# EAGLE design audio_board (EAGLE 9.0.1)
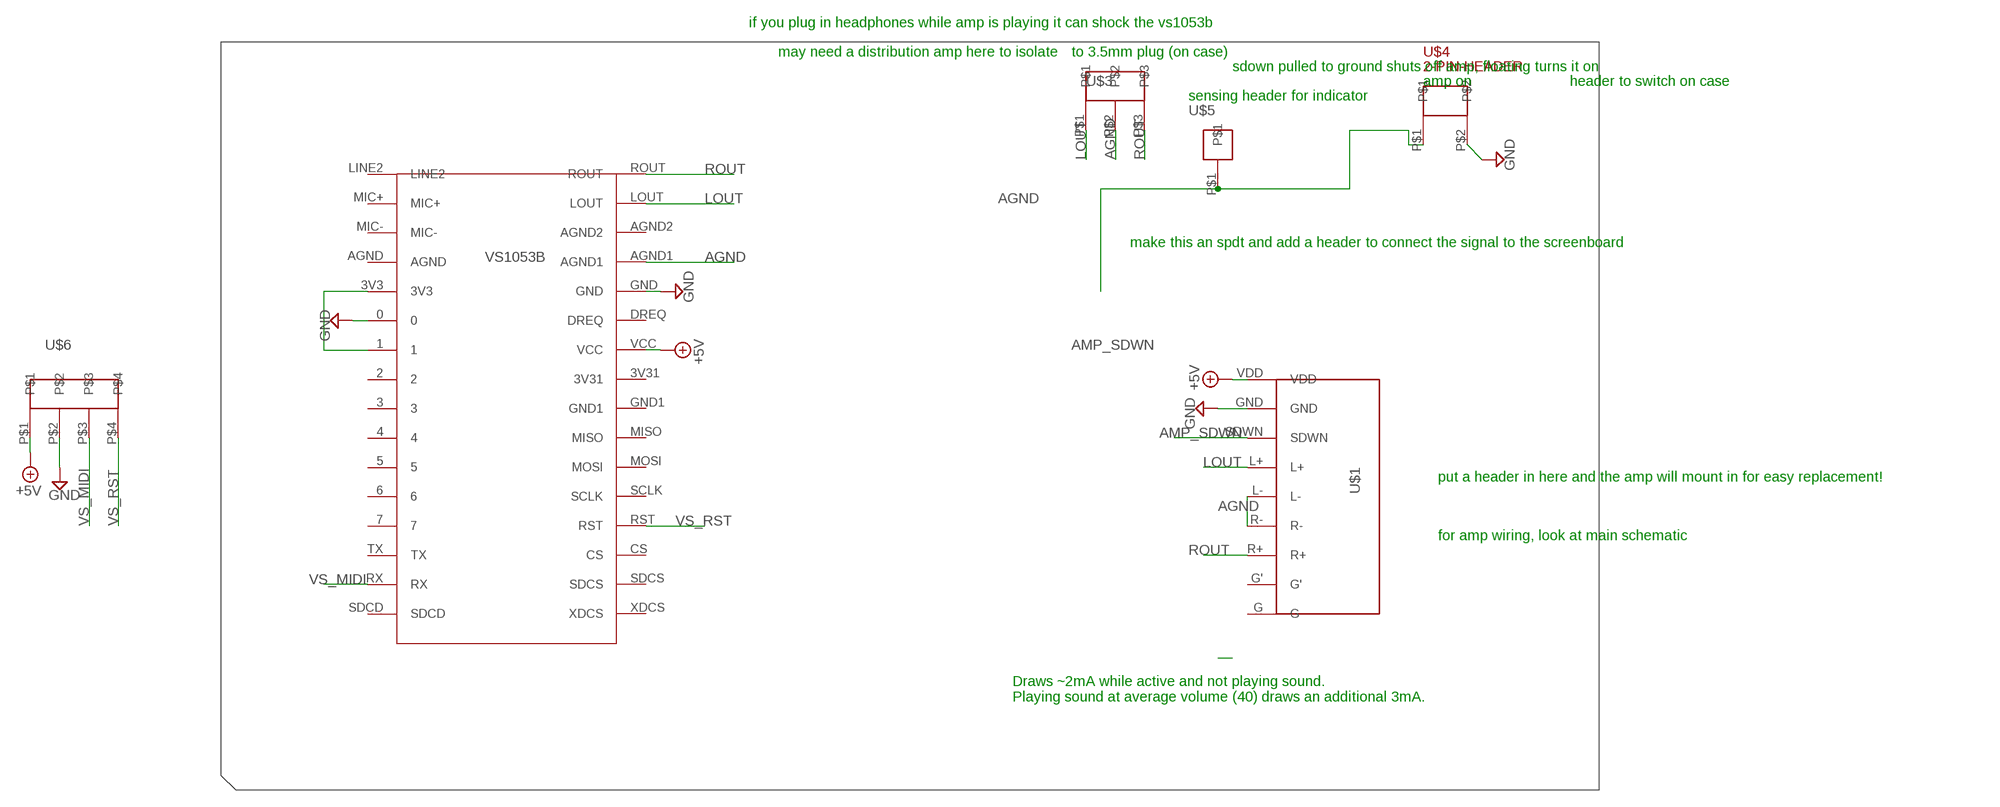
[diagram p0: schematic, sheet 1]

## Parts
U$1  AUDIOAMP  [AUDIOAMP]
U$3  3-PIN-HEADER  [3-PIN-HEADER]
U$4  2-PIN-HEADER  [2-PIN-HEADER]
U$5  1-PIN-HEADER  [1-PIN-HEADER]
U$6  4-PIN-HEADER  [4-PIN-HEADER]
VS1053B  VS1053B  [VS1053B]

## Nets
+5V: U$1.VDD U$6.P$1 VS1053B.VCC
AGND: U$1.L- U$1.R- U$3.P$2 VS1053B.AGND1
AMP_SDWN: U$1.SDWN U$4.P$1 U$5.P$1
GND: U$1.GND U$4.P$2 U$6.P$2 VS1053B.0 VS1053B.GND
LOUT: U$1.L+ U$3.P$1 VS1053B.LOUT
N$1: VS1053B.1 VS1053B.3V3
ROUT: U$1.R+ U$3.P$3 VS1053B.ROUT
VS_MIDI: U$6.P$3 VS1053B.RX
VS_RST: U$6.P$4 VS1053B.RST
Unconnected: U$1.G U$1.G' VS1053B.2 VS1053B.3 VS1053B.3V31 VS1053B.4 VS1053B.5 VS1053B.6 VS1053B.7 VS1053B.AGND VS1053B.AGND2 VS1053B.CS VS1053B.DREQ VS1053B.GND1 VS1053B.LINE2 VS1053B.MIC+ VS1053B.MIC- VS1053B.MISO VS1053B.MOSI VS1053B.SCLK VS1053B.SDCD VS1053B.SDCS VS1053B.TX VS1053B.XDCS

## Notes on the sheet
- if you plug in headphones while amp is playing it can shock the vs1053b
- may need a distribution amp here to isolate | to 3.5mm plug (on case)
- sdown pulled to ground shuts off amp, floating turns it on
- amp on | header to switch on case
- sensing header for indicator
- make this an spdt and add a header to connect the signal to the screenboard
- put a header in here and the amp will mount in for easy replacement!
- for amp wiring, look at main schematic
- Draws ~2mA while active and not playing sound.
  Playing sound at average volume (40) draws an additional 3mA.

## Library data of the parts
U$1 = mask_lbr:AUDIOAMP
U$3 = mask_lbr:3-PIN-HEADER
U$4 = mask_lbr:2-PIN-HEADER
U$5 = mask_lbr:1-PIN-HEADER
U$6 = mask_lbr:4-PIN-HEADER
VS1053B = mask_lbr:VS1053B

## Net classes
0 default: width 0.508 mm, clearance 0.381 mm

## Board
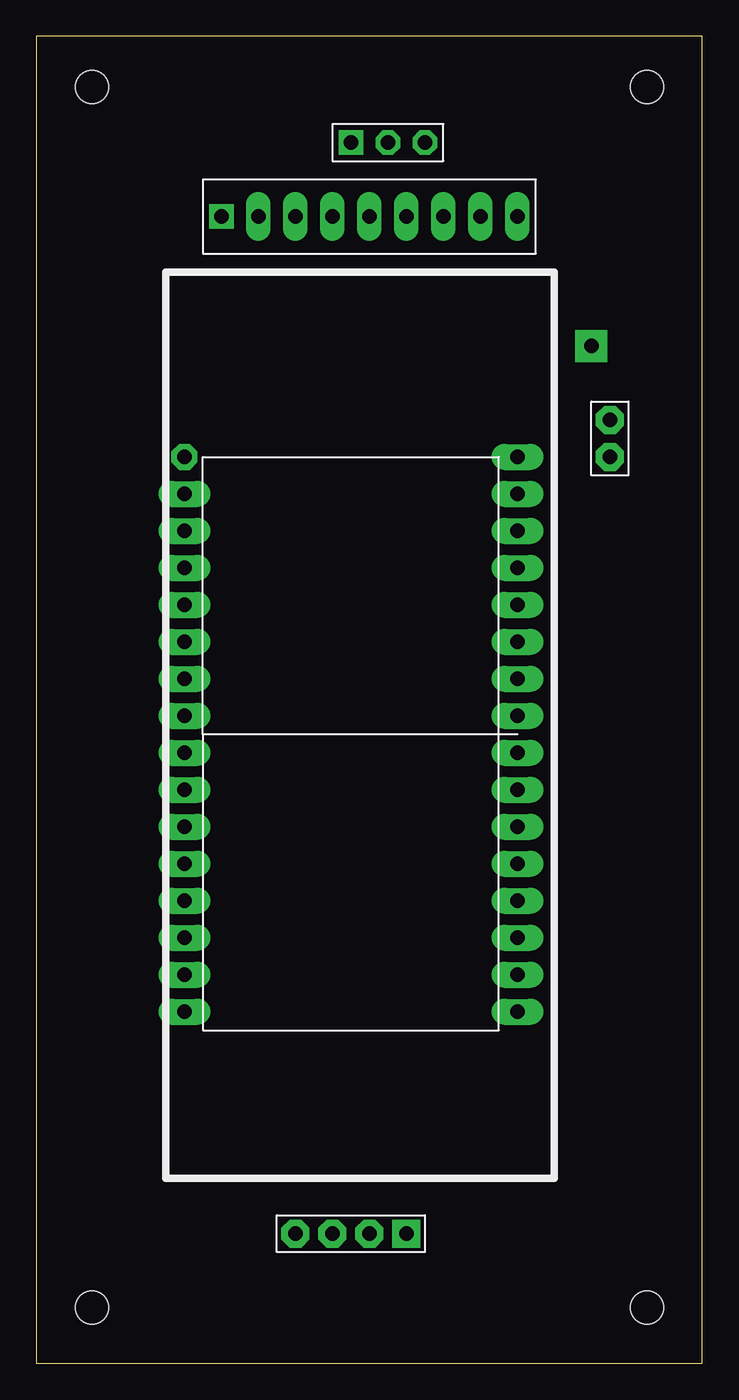
[diagram p1: board, top side]
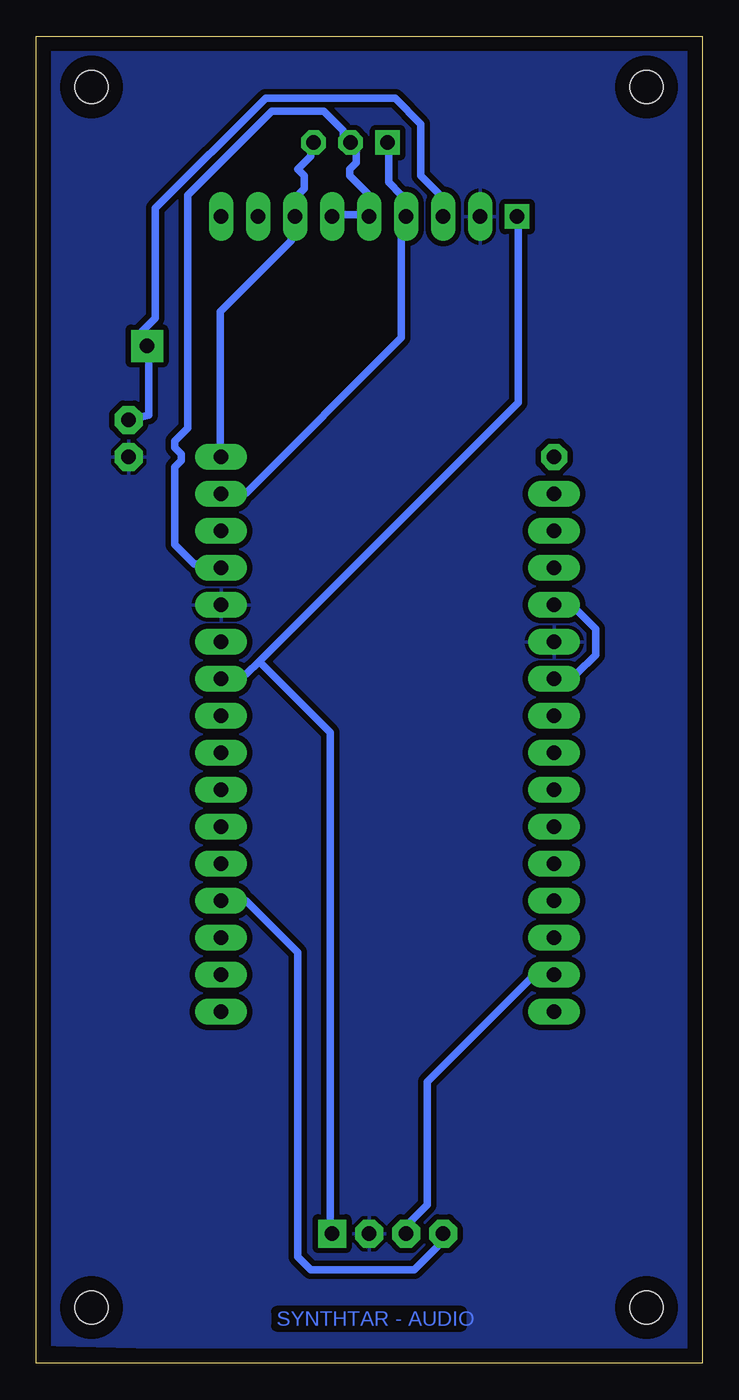
[diagram p2: board, bottom side, seen from below]

Size 45.7 x 91.11 mm. Coordinates in mm from the lower left corner, seen from the top.
Outline: 0,0 45.7,0 45.7,91.11 0,91.11 0,0
Copper layers (1*16): Top 0.035mm / dielectric 1.5mm / Bottom 0.035mm
Design rules "default": minimum track width 6mil, minimum drill 0.35mm, track to track 6mil, track to pad 6mil, pad to pad 6mil, via to via 6mil, smd to smd 6mil, copper to edge 40mil, drill to drill 6mil, minimum pad ring 10mil, minimum via ring 8mil, stop-mask expansion 4mil, vias tented up to drill 0mil, thermal gap 10mil
Holes 2.26 mm at 3.81,3.81 41.91,3.81 41.91,87.63 3.81,87.63

### Footprints (pad centres in the part's own frame; a part is rotated, then mirrored left to right if it is on the bottom)
AUDIOAMP = drill 1 pad 1.676 long: G 10.16,0; G' 7.62,0; GND -7.62,0; L+ -2.54,0; L- 0,0; R+ 5.08,0; R- 2.54,0; SDWN -5.08,0 | drill 1 pad 1.676 square: VDD -10.16,0
3-PIN-HEADER = drill 1 pad 1.676 square: P$1 -2.54,0 | drill 1 pad 1.676 octagon: P$2 0,0; P$3 2.54,0
2-PIN-HEADER = drill 1 pad 1.93 octagon: P$1 -1.27,0; P$2 1.27,0
1-PIN-HEADER = drill 1 pad 2.184 square: P$1 0,0
4-PIN-HEADER = drill 1 pad 1.93 square: P$1 -3.81,0 | drill 1 pad 1.93 octagon: P$2 -1.27,0; P$3 1.27,0; P$4 3.81,0
VS1053B = drill 1 pad 1.778 long: 0 -11.43,6.35; 1 -11.43,3.81; 2 -11.43,1.27; 3 -11.43,-1.27; 3V3 -11.43,8.89; 3V31 11.43,1.27; 4 -11.43,-3.81; 5 -11.43,-6.35; 6 -11.43,-8.89; 7 -11.43,-11.43; AGND -11.43,11.43; AGND1 11.43,11.43; AGND2 11.43,13.97; CS 11.43,-13.97; DREQ 11.43,6.35; GND 11.43,8.89; GND1 11.43,-1.27; LOUT 11.43,16.51; MIC+ -11.43,16.51; MIC- -11.43,13.97; MISO 11.43,-3.81; MOSI 11.43,-6.35; ROUT 11.43,19.05; RST 11.43,-11.43; RX -11.43,-16.51; SCLK 11.43,-8.89; SDCD -11.43,-19.05; SDCS 11.43,-16.51; TX -11.43,-13.97; VCC 11.43,3.81; XDCS 11.43,-19.05 | drill 1 pad 1.778 octagon: LINE2 -11.43,19.05

### Placement (x,y rotation side)
U$1  22.86,78.74 0 top
U$3  24.13,83.82 0 top
U$4  39.37,63.5 270 top
U$5  38.1,69.85 0 top
U$6  21.59,8.89 180 top
VS1053B  21.59,43.18 0 top

### Tracks (layer width: path | path; a pad name or v marks a point on that pad's centre or on a via)
+5V
  Bottom 0.508: 30.42,48.2 31.31,47.31 32.64,47.31 VS1053B.VCC | 30.42,48.2 12.64,65.98 12.64,78.42 U$1.VDD | 30.42,48.2 25.53,43.31 25.53,9.08 U$6.P$1
AGND
  Bottom 0.508: 22.86,78.87 25.08,78.87 U$1.R- | 22.86,78.87 22.86,80.2 24.19,81.53 24.19,81.98 23.75,82.42 23.75,83.76 U$3.P$2 24.19,83.76 24.64,83.76 24.64,84.65 25.97,85.98 29.53,85.98 35.31,80.2 35.31,64.2 36.2,63.31 36.2,62.86 35.75,62.42 35.75,61.98 36.2,61.53 36.2,56.2 34.86,54.86 33.08,54.86 VS1053B.AGND1 | 22.86,78.87 U$1.L-
AMP_SDWN
  Bottom 0.508: U$1.SDWN 17.97,78.87 17.97,80.2 19.3,81.53 19.3,85.09 21.08,86.87 29.97,86.87 37.53,79.31 37.53,71.75 38.42,70.87 38.42,69.98 U$5.P$1 37.97,69.53 37.97,65.09 U$4.P$1
GND
  pour Bottom: -3.81,91.44 45.72,91.44 45.72,1.27 -5.08,0 -5.08,74.93
LOUT
  Bottom 0.508: U$3.P$1 21.53,83.76 21.53,81.09 20.64,80.2 20.64,78.87 U$1.L+ 20.64,78.42 20.64,70.42 31.31,59.75 32.64,59.75 VS1053B.LOUT
N$1
  Bottom 0.508: VS1053B.1 9.97,47.31 8.64,47.31 7.3,48.64 7.3,50.42 8.64,51.75 9.97,51.75 VS1053B.3V3
ROUT
  Bottom 0.508: U$3.P$3 26.86,83.76 26.86,82.87 27.75,81.98 27.31,81.53 27.31,80.64 27.75,80.2 27.75,78.87 U$1.R+ 28.19,78.42 28.19,77.09 33.08,72.2 33.08,62.42 VS1053B.ROUT
VS_MIDI
  Bottom 0.508: VS1053B.RX 10.41,26.42 11.75,26.42 18.86,19.3 18.86,10.86 20.64,9.08 U$6.P$3
VS_RST
  Bottom 0.508: VS1053B.RST 31.31,31.75 27.75,28.19 27.75,7.3 26.86,6.41 19.75,6.41 17.53,8.64 U$6.P$4

### Text on the board
Bottom: SYNTHTAR - AUDIO